# Altium project MCU.PrjPCB
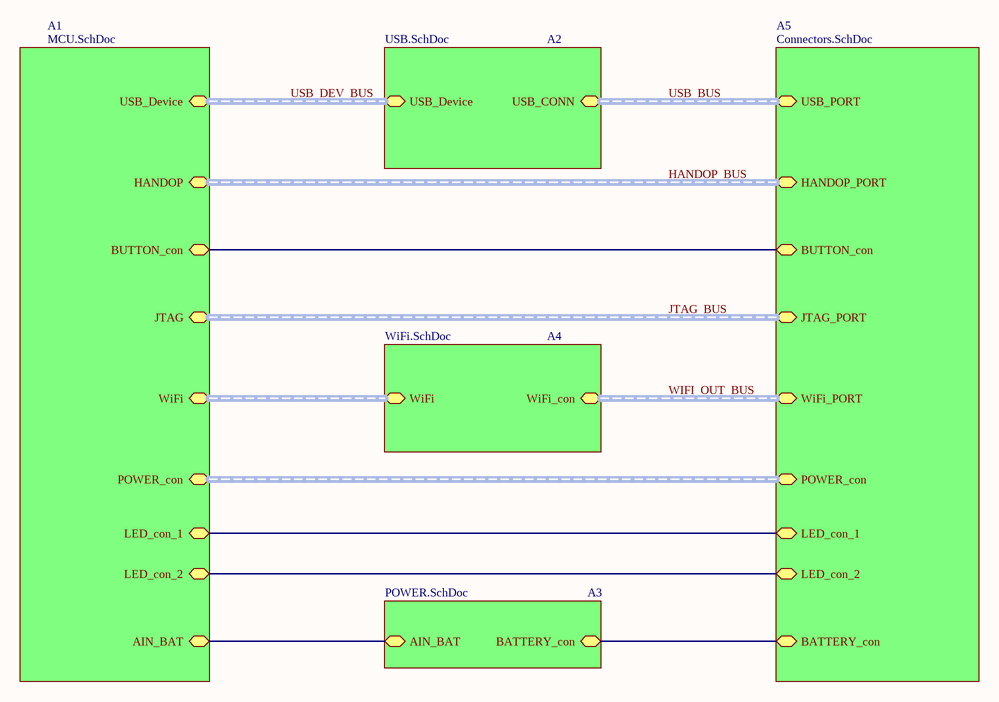
[diagram p0: main.SchDoc]
6 sheets, 81 parts. Net scope: hierarchical (ports join the sheet entries above them; power ports are global).
Board file: MCU.PcbDoc
Sheets:
  main.SchDoc
    A1 = MCU.SchDoc
    A2 = USB.SchDoc
    A3 = POWER.SchDoc
    A4 = WiFi.SchDoc
    A5 = Connectors.SchDoc

## Sheet main.SchDoc
size A4

### Sub-sheets
A1 = MCU.SchDoc: USB_Device (harness USB), WiFi (harness WiFi), AIN_BAT, HANDOP (harness HANDOP_connector), BUTTON_con, LED_con_1, POWER_con (harness POWER), JTAG (harness JTAG_connector), LED_con_2
A2 = USB.SchDoc: USB_Device (harness USB), USB_CONN (harness USB_connector)
A3 = POWER.SchDoc: AIN_BAT, BATTERY_con
A4 = WiFi.SchDoc: WiFi (harness WiFi), WiFi_con (harness WiFi_connector)
A5 = Connectors.SchDoc: WiFi_PORT (harness WiFi_connector), BATTERY_con, HANDOP_PORT (harness HANDOP_connector), BUTTON_con, LED_con_1, POWER_con (harness POWER), JTAG_PORT (harness JTAG_connector), USB_PORT (harness USB_connector), LED_con_2

### Nets
BUTTON_con: sheet A1/BUTTON_con, sheet A5/BUTTON_con
NetC24_1: sheet A1/AIN_BAT, sheet A3/AIN_BAT
NetR8_1: sheet A1/LED_con_1, sheet A5/LED_con_1
NetR15_2: sheet A3/BATTERY_con, sheet A5/BATTERY_con
NetR30_2: sheet A1/LED_con_2, sheet A5/LED_con_2

### Buses and harness runs
harness HANDOP_BUS = sheet A1/HANDOP = sheet A5/HANDOP_PORT
harness JTAG_BUS = sheet A1/JTAG = sheet A5/JTAG_PORT
harness sheet A1/POWER_con = sheet A5/POWER_con
harness sheet A1/WiFi = sheet A4/WiFi
harness USB_BUS = sheet A2/USB_CONN = sheet A5/USB_PORT
harness USB_DEV_BUS = sheet A1/USB_Device = sheet A2/USB_Device
harness WIFI_OUT_BUS = sheet A4/WiFi_con = sheet A5/WiFi_PORT

## Sheet MCU.SchDoc
size 420 x 297 mm; Scale: 1:1; DocumentType: Схема электрическая принципиальная; FirstReferrence: АБВГ.123456.001
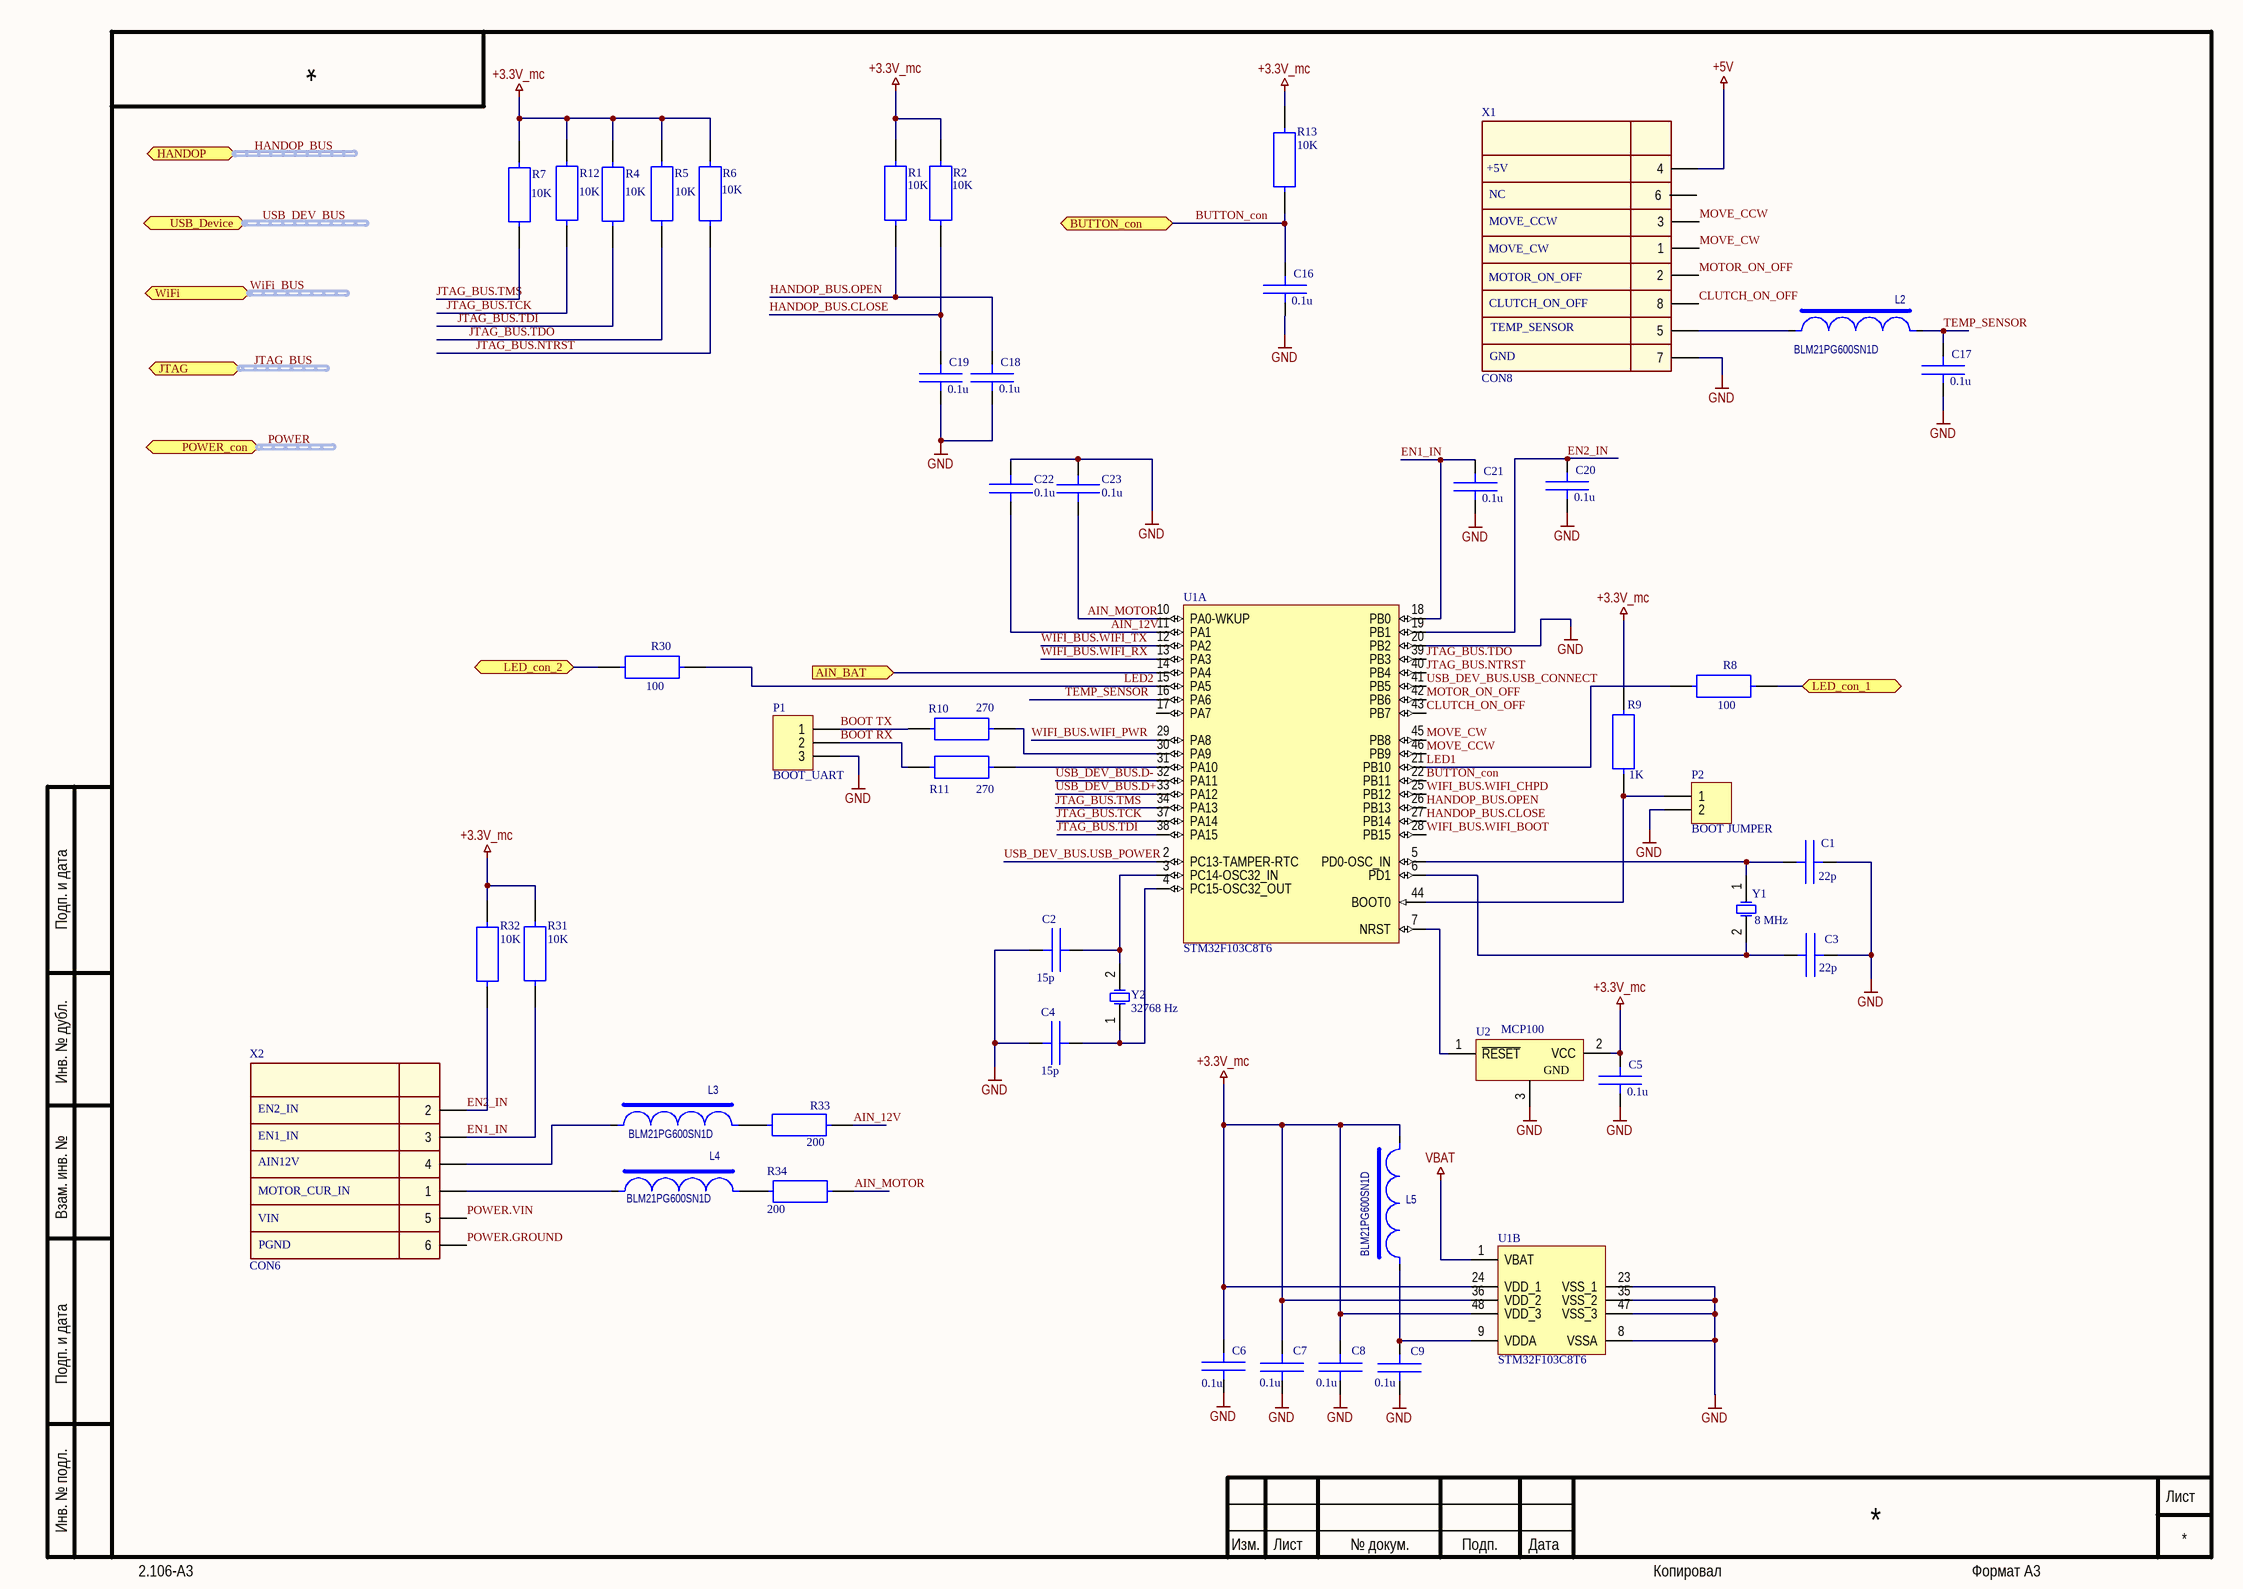
[diagram p1: MCU.SchDoc]

### Parts
C1  22p  [0603C]
C2  15p  [0603C]
C3  22p  [0603C]
C4  15p  [0603C]
C5  0.1u  [0603C]
C6  0.1u  [0603C]
C7  0.1u  [0603C]
C8  0.1u  [0603C]
C9  0.1u  [0603C]
C16  0.1u  [0603C]
C17  0.1u  [0603C]
C18  0.1u  [0603C]
C19  0.1u  [0603C]
C20  0.1u  [0603C]
C21  0.1u  [0603C]
C22  0.1u  [0603C]
C23  0.1u  [0603C]
L2  BLM21PG600SN1D  [0805]
L3  BLM21PG600SN1D  [0805]
L4  BLM21PG600SN1D  [0805]
L5  BLM21PG600SN1D  [0805]
P1  BOOT_UART  [HDR1X3]
P2  BOOT JUMPER  [HDR1X2]
R1  10K  [0603R]
R2  10K  [0603R]
R4  10K  [0603R]
R5  10K  [0603R]
R6  10K  [0603R]
R7  10K  [0603R]
R8  100  [0603R]
R9  1K  [0603R]
R10  270  [0603R]
R11  270  [0603R]
R12  10K  [0603R]
R13  10K  [0603R]
R30  100  [0603R]
R31  10K  [0603R]
R32  10K  [0603R]
R33  200  [0603R]
R34  200  [0603R]
U1  STM32F103C8T6  [LQFP48_L]  (parts A,B of 2)
U2  MCP100  [SOT95P230X110-3L]
X1  CON8  [HDR2X4_CEN]
X2  CON6  [HDR2X3_CEN]
Y1  8 MHz  [HC49(CRYSTAL)]
Y2  32768 Hz  [XTAL 32kHz -1]

### Ports
AIN_BAT (in), BUTTON_con, HANDOP (harness HANDOP_connector), JTAG (harness JTAG_connector), LED_con_1, LED_con_2, POWER_con (harness POWER), USB_Device (harness USB), WiFi (harness WiFi)

### Nets
+3.3V_mc: C5.2 C6.2 C7.2 C8.2 L5.2 R1.2 R2.2 R4.2 R5.2 R6.2 R7.2 R9.2 R12.2 R13.2 R31.1 R32.1 U1.24(VDD_1) U1.36(VDD_2) U1.48(VDD_3) U2.2(VСС)
+5V: X1.4
GND: C1.1 C2.1 C3.1 C4.1 C5.1 C6.1 C7.1 C8.1 C9.1 C16.1 C17.1 C18.1 C19.1 C20.1 C21.1 C22.1 C23.1 P1.3 P2.2 U1.8(VSSA) U1.20(PB2) U1.23(VSS_1) U1.35(VSS_2) U1.47(VSS_3) U2.3(GND) X1.7
VBAT: U1.1(VBAT)
AIN_12V: C22.2 R33.2 U1.11(PA1)
AIN_MOTOR: C23.2 R34.2 U1.10(PA0-WKUP)
BOOT RX: P1.2 R11.1
BOOT TX: P1.1 R10.1
BUTTON_con: C16.2 R13.1 U1.22(PB11) ; port BUTTON_con
CLUTCH_ON_OFF: U1.43(PB7) X1.8
EN1_IN: C21.2 R31.2 U1.18(PB0) X2.3
EN2_IN: C20.2 R32.2 U1.19(PB1) X2.2
HANDOP_BUS.CLOSE: C19.2 R2.1 U1.27(PB14)
HANDOP_BUS.OPEN: C18.2 R1.1 U1.26(PB13)
JTAG_BUS.NTRST: R6.1 U1.40(PB4)
JTAG_BUS.TCK: R12.1 U1.37(PA14)
JTAG_BUS.TDI: R4.1 U1.38(PA15)
JTAG_BUS.TDO: R5.1 U1.39(PB3)
JTAG_BUS.TMS: R7.1 U1.34(PA13)
LED1: R8.2 U1.21(PB10)
LED2: R30.1 U1.15(PA5)
MOTOR_ON_OFF: U1.42(PB6) X1.2
MOVE_CCW: U1.46(PB9) X1.3
MOVE_CW: U1.45(PB8) X1.1
POWER.GROUND: X2.6
POWER.VIN: X2.5
TEMP_SENSOR: C17.2 L2.2 U1.16(PA6)
USB_DEV_BUS.D+: U1.33(PA12)
USB_DEV_BUS.D-: U1.32(PA11)
USB_DEV_BUS.USB_CONNECT: U1.41(PB5)
USB_DEV_BUS.USB_POWER: U1.2(PC13-TAMPER-RTC)
WIFI_BUS.WIFI_BOOT: U1.28(PB15)
WIFI_BUS.WIFI_CHPD: U1.25(PB12)
WIFI_BUS.WIFI_PWR: U1.29(PA8)
WIFI_BUS.WIFI_RX: U1.13(PA3)
WIFI_BUS.WIFI_TX: U1.12(PA2)
NetC1_2: C1.2 U1.5(PD0-OSC_IN) Y1.1(OSC1)
NetC2_2: C2.2 U1.3(PC14-OSC32_IN) Y2.2(OSC2)
NetC3_2: C3.2 U1.6(PD1) Y1.2(OSC2)
NetC4_2: C4.2 U1.4(PC15-OSC32_OUT) Y2.1(OSC1)
NetC9_2: C9.2 L5.1 U1.9(VDDA)
NetC24_1: U1.14(PA4) ; port AIN_BAT
NetL2_1: L2.1 X1.5
NetL3_1: L3.1 X2.4
NetL3_2: L3.2 R33.1
NetL4_1: L4.1 X2.1
NetL4_2: L4.2 R34.1
NetP2_1: P2.1 R9.1 U1.44(BOOT0)
NetR8_1: R8.1 ; port LED_con_1
NetR10_2: R10.2 U1.30(PA9)
NetR11_2: R11.2 U1.31(PA10)
NetR30_2: R30.2 ; port LED_con_2
NetU1_7: U1.7(NRST) U2.1(~{RESET})

Not connected (* = marked no-connect by the designer): U1 17(PA7); X1 6

### Buses and harness runs
harness HANDOP_BUS = port HANDOP
harness JTAG_BUS = port JTAG
harness POWER = port POWER_con
harness USB_DEV_BUS = port USB_Device
harness WiFi_BUS = port WiFi

### Notes on the sheet
- +5V
- MOVE_CW
- MOVE_CCW
- NC
- MOTOR_ON_OFF
- CLUTCH_ON_OFF
- GND
- TEMP_SENSOR
- EN1_IN
- EN2_IN
- MOTOR_CUR_IN
- AIN12V
- VIN
- PGND
- Подп. и дата
- Инв. № дубл.
- Взам. инв. №
- Инв. № подл.
- Изм.
- Лист
- № докум.
- Подп.
- Дата
- 2.106-A3
- Копировал
- Формат А3

### Library data of the parts
C1-C9 C16-C23 = CAP: Конденсатор обыкновенный
  C1 C3: Value: 22p
  C2 C4: Value: 15p
  C5-C9 C16-C23: Value: 0.1u
L2-L5 = INDUCTOR_: Индуктивность
P1 = Header 3: Header, 3-Pin; LatestRevisionDate: 17-Jul-2002; LatestRevisionNote: Re-released for DXP Platform.; Publisher: Altium Limited
P2 = Header 2: Header, 2-Pin; LatestRevisionDate: 17-Jul-2002; LatestRevisionNote: Re-released for DXP Platform.; Publisher: Altium Limited
R1 R2 R4-R13 R30-R34 = RES: Резистор обыкновенный
  R1 R2 R4-R7 R12 R13 R31 R32: Value: 10K
  R8 R30: Value: 100
  R9: Value: 1K
  R10 R11: Value: 270
  R33 R34: Value: 200
U1 = STM32F103C8T6: STM32 ARM-based 32-bit MCU Performance Line with 64 kB Flash, 20 kB Internal RAM, -40 to +85°C Temperature, 48-Pin LQFP, Tray; DatasheetVersion: rev13.0, Apr-2011; PackageVersion: rev13, Apr-2011; PackageReference: LQFP48; PackageDescription: 48-Pin Low-Profile Quad Flat Pack, 7 x 7 mm Body, 0.5 mm Pitch (LQFP48); ComponentLink1Description: Manufacturer URL; ComponentLink1URL: http://www.st.com/; ComponentLink2Description: STM32F103 Datasheet; ComponentLink2URL: http://www.st.com/internet/com/TECHNICAL_RESOURCES/TECHNICAL_LITERATURE/DATASHEET/CD00161566.pdf; ComponentLink3Description: STM32 Family Web Page; ComponentLink3URL: www.st.com/stm32
U2 = RESET_CIRCUIT: RESET CIRCUIT
X1 = CON8: штыри(папа)
X2 = CON6: штыри(папа)
Y1 Y2 = XTAL: Crystal Oscillator; Published: 8-Jun-2000; LatestRevisionDate: 17-Jul-2002; LatestRevisionNote: Re-released for DXP Platform.; PackageReference: R38; Publisher: Altium Limited; PackageDescription: Crystal, Thru-Hole; 2 Leads; Body 3.1 x 8.2 mm (Dia.xH)

## Sheet USB.SchDoc
size 420 x 297 mm; Scale: 1:1; DocumentType: Схема электрическая принципиальная; FirstReferrence: АБВГ.123456.001
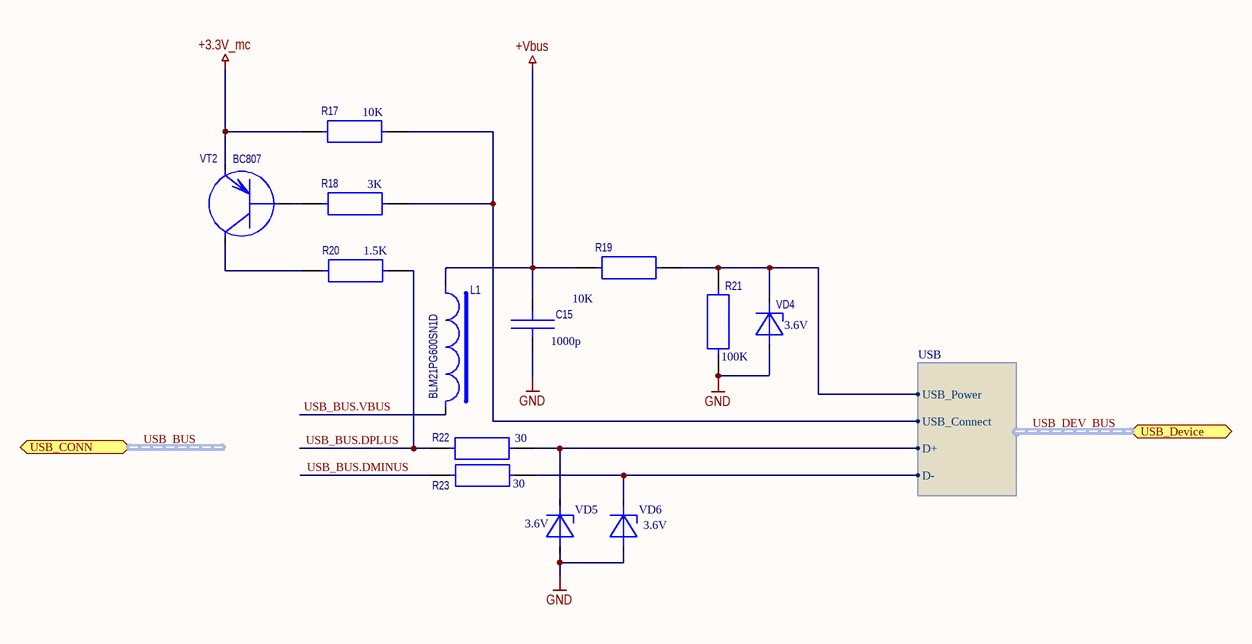
[diagram p2: USB.SchDoc]

### Parts
C15  1000p  [0603C]
L1  BLM21PG600SN1D  [0805]
R17  10K  [0603R]
R18  3K  [0603R]
R19  10K  [0603R]
R20  1.5K  [0603R]
R21  100K  [0603R]
R22  30  [0603R]
R23  30  [0603R]
VD4  value 3.6V  [SOT23_1DIODE]  (hidden comment: BZX84C3V6)
VD5  value 3.6V  [SOT23_1DIODE]  (hidden comment: BZX84C3V6)
VD6  value 3.6V  [SOT23_1DIODE]  (hidden comment: BZX84C3V6)
VT2  BC807  [SOT95P230X110-3L]

### Ports
USB_CONN (harness USB_connector), USB_Device (harness USB)

### Harnesses
USB: USB_Connect, USB_Power, D+, D-

### Nets
+3.3V_mc: R17.2 VT2.2(E)
+Vbus: C15.2 L1.1 R19.2
GND: C15.1 R21.1 VD4.A VD5.A VD6.A
USB_BUS.DMINUS: R23.1
USB_BUS.DPLUS: R20.1 R22.1
USB_BUS.VBUS: L1.2
USB_DEV_BUS.D+: R22.2 VD5.K ; port USB_Device.D+
USB_DEV_BUS.D-: R23.2 VD6.K ; port USB_Device.D-
USB_DEV_BUS.USB_Connect: R17.1 R18.1 ; port USB_Device.USB_Connect
USB_DEV_BUS.USB_Power: R19.1 R21.2 VD4.K ; port USB_Device.USB_Power
NetR18_2: R18.2 VT2.1(B)
NetR20_2: R20.2 VT2.3(C)

### Buses and harness runs
harness USB_BUS = port USB_CONN
harness USB_DEV_BUS = port USB_Device

### Notes on the sheet
- Подп. и дата
- Инв. № дубл.
- Взам. инв. №
- Инв. № подл.
- Изм.
- Лист
- № докум.
- Подп.
- Дата
- 2.106-A3
- Копировал
- Формат А3

### Library data of the parts
C15 = CAP: Конденсатор обыкновенный; Value: 1000p
L1 = INDUCTOR_: Индуктивность
R17-R23 = RES: Резистор обыкновенный
  R17 R19: Value: 10K
  R18: Value: 3K
  R20: Value: 1.5K
  R21: Value: 100K
  R22 R23: Value: 30
VD4-VD6 = ZENNER: Стабилитрон
VT2 = SOT32_PNP: Биполярный PNP транзистор

## Sheet POWER.SchDoc
size A4
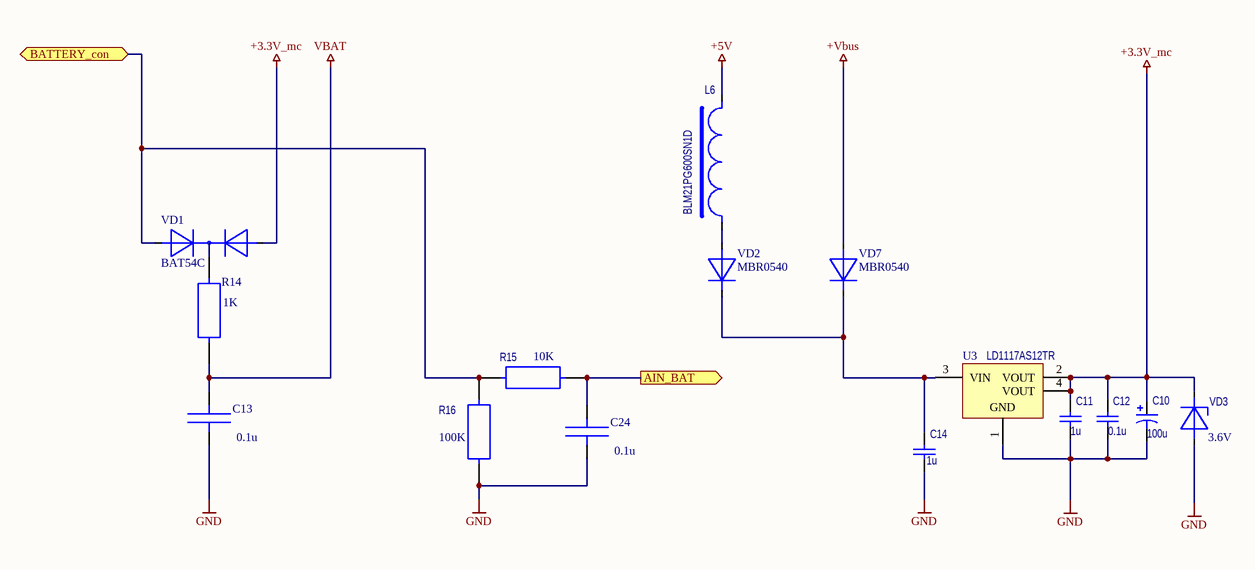
[diagram p3: POWER.SchDoc]

### Parts
C10  value 100u  [CAP 5X...Х2]  (hidden comment: 100u 6.3V)
C11  1u  [1206C]
C12  0.1u  [0603C]
C13  0.1u  [0603C]
C14  1u  [0603C]
C24  0.1u  [0603C]
L6  BLM21PG600SN1D  [0805]
R14  1K  [0603R]
R15  10K  [0603R]
R16  100K  [0603R]
U3  LD1117AS12TR  [SOT223]
VD1  BAT54C  [SOT95P230X110-3L]
VD2  MBR0540  [SOD123]
VD3  value 3.6V  [SOT23_1DIODE]  (hidden comment: BZX84C3V6)
VD7  MBR0540  [SOD123]

### Ports
AIN_BAT (out), BATTERY_con

### Nets
+3.3V_mc: C10.1 C11.2 C12.2 U3.2(VOUT) U3.4(VOUT) VD1.1(A1) VD3.K
+5V: L6.2
+Vbus: VD7.A
GND: C10.2 C11.1 C12.1 C13.2 C14.1 C24.2 R16.1 U3.1(GND) VD3.A
VBAT: C13.1 R14.2
NetC14_2: C14.2 U3.3(VIN) VD2.K VD7.K
NetC24_1: C24.1 R15.1 ; port AIN_BAT
NetL6_1: L6.1 VD2.A
NetR14_1: R14.1 VD1.3(K)
NetR15_2: R15.2 R16.2 VD1.2(A2) ; port BATTERY_con

### Library data of the parts
C10 = Cap Pol1: Polarized Capacitor (Radial); Published: 8-Jun-2000; LatestRevisionDate: 17-Jul-2002; LatestRevisionNote: Re-released for DXP Platform.; PackageReference: RB7.6-15; Publisher: Altium Limited
C11 C12 C14 = Cap: Capacitor; Published: 8-Jun-2000; LatestRevisionDate: 17-Jul-2002; LatestRevisionNote: Re-released for DXP Platform.; PackageReference: RAD-0.3; Publisher: Altium Limited
  C11 C14: Value: 1u
  C12: Value: 0.1u
C13 C24 = CAP: Конденсатор обыкновенный; Part Name: C-0603Y5V-104-20% (50v); Value: 0.1u
L6 = INDUCTOR_: Индуктивность
R14 = RES: Резистор обыкновенный; Part Name: R-0603-270R-5; Value: 1K
R15 R16 = RES: Резистор обыкновенный
  R15: Value: 10K
  R16: Value: 100K
U3 = LD1117AS12TR: 1A, Low Drop Positive Voltage Regulator, 1.2V, 4-Pin SOT-223, Tape and Reel; DatasheetVersion: Dec-2011; PackageVersion: 2010; PackageReference: SOT-223; PackageDescription: 4-Pin SOT-223 Package, 6.5 x 3.5 mm Body, 2.3 mm Pitch, 7 mm Lead Span; PartNumber: LD1117AS12TR; ComponentLink1Description: Manufacturer URL; ComponentLink1URL: http://www.st.com; ComponentLink2Description: Datasheet; ComponentLink2URL: http://www.st.com/internet/com/TECHNICAL_RESOURCES/TECHNICAL_LITERATURE/DATASHEET/CD00002116.pdf
VD1 = DIODE_PAIR_C: диодная сборка(общий катод); Part Name: BAT54C
VD2 VD7 = DIODE: Диод
VD3 = ZENNER: Стабилитрон

## Sheet WiFi.SchDoc
size A4
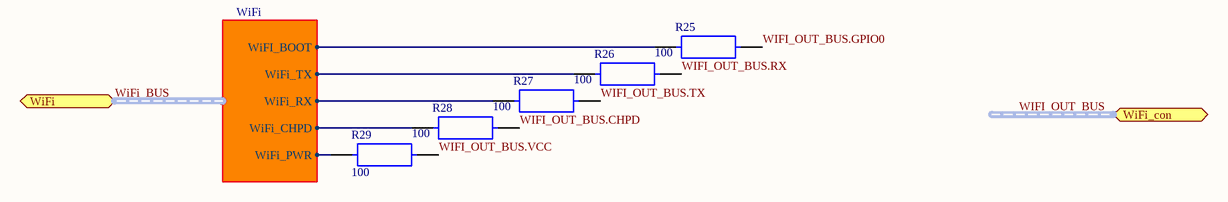
[diagram p4: WiFi.SchDoc]

### Parts
R25  100  [0603R]
R26  100  [0603R]
R27  100  [0603R]
R28  100  [0603R]
R29  100  [0603R]

### Ports
WiFi (harness WiFi), WiFi_con (harness WiFi_connector)

### Harnesses
WiFi: WiFi_PWR, WiFi_CHPD, WiFi_RX, WiFi_TX, WiFI_BOOT

### Nets
WiFi_BUS.WiFI_BOOT: R25.2 ; port WiFi.WiFI_BOOT
WiFi_BUS.WiFi_CHPD: R28.2 ; port WiFi.WiFi_CHPD
WiFi_BUS.WiFi_PWR: R29.2 ; port WiFi.WiFi_PWR
WiFi_BUS.WiFi_RX: R27.2 ; port WiFi.WiFi_RX
WiFi_BUS.WiFi_TX: R26.2 ; port WiFi.WiFi_TX
WIFI_OUT_BUS.CHPD: R28.1
WIFI_OUT_BUS.GPIO0: R25.1
WIFI_OUT_BUS.RX: R26.1
WIFI_OUT_BUS.TX: R27.1
WIFI_OUT_BUS.VCC: R29.1

### Buses and harness runs
harness WiFi_BUS = port WiFi
harness WIFI_OUT_BUS = port WiFi_con

### Library data of the parts
R25-R29 = RES: Резистор обыкновенный; Value: 100

## Sheet Connectors.SchDoc
size A4
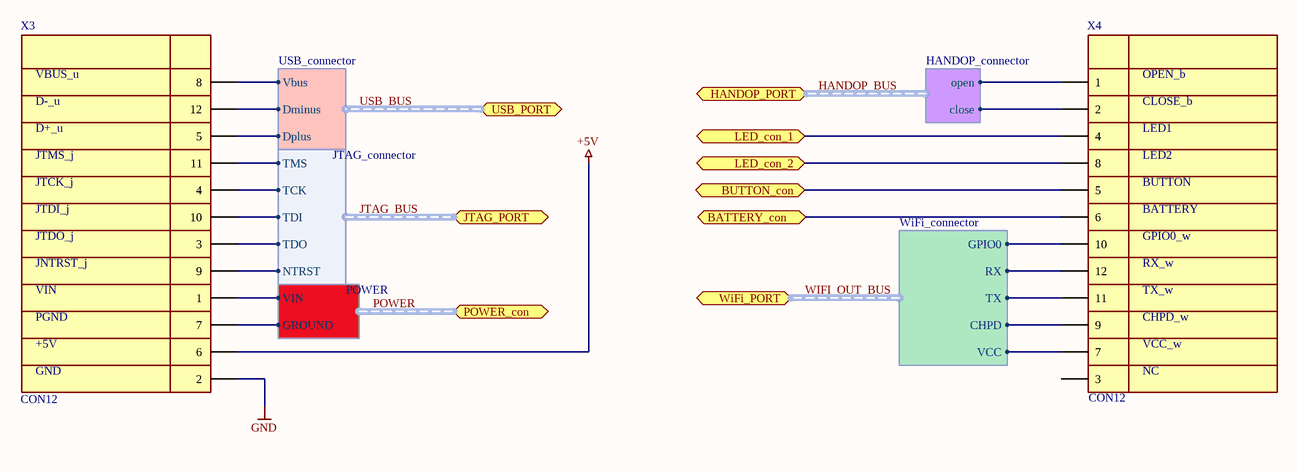
[diagram p5: Connectors.SchDoc]

### Parts
X3  CON12  [HDR2X6_CEN]
X4  CON12  [HDR2X6_CEN]

### Ports
BATTERY_con, BUTTON_con, HANDOP_PORT (harness HANDOP_connector), JTAG_PORT (harness JTAG_connector), LED_con_1, LED_con_2, POWER_con (harness POWER), USB_PORT (harness USB_connector), WiFi_PORT (harness WiFi_connector)

### Harnesses
HANDOP_connector: open, close
WiFi_connector: GPIO0, RX, TX, CHPD, VCC
POWER: VIN, GROUND
JTAG_connector: TMS, TCK, TDI, TDO, NTRST
USB_connector: Vbus, Dminus, Dplus

### Nets
+5V: X3.6
GND: X3.2
BUTTON_con: X4.5 ; port BUTTON_con
HANDOP_BUS.close: X4.2 ; port HANDOP_PORT.close
HANDOP_BUS.open: X4.1 ; port HANDOP_PORT.open
JTAG_BUS.NTRST: X3.9 ; port JTAG_PORT.NTRST
JTAG_BUS.TCK: X3.4 ; port JTAG_PORT.TCK
JTAG_BUS.TDI: X3.10 ; port JTAG_PORT.TDI
JTAG_BUS.TDO: X3.3 ; port JTAG_PORT.TDO
JTAG_BUS.TMS: X3.11 ; port JTAG_PORT.TMS
POWER.GROUND: X3.7 ; port POWER_con.GROUND
POWER.VIN: X3.1 ; port POWER_con.VIN
USB_BUS.Dminus: X3.12 ; port USB_PORT.Dminus
USB_BUS.Dplus: X3.5 ; port USB_PORT.Dplus
USB_BUS.Vbus: X3.8 ; port USB_PORT.Vbus
WIFI_OUT_BUS.CHPD: X4.9 ; port WiFi_PORT.CHPD
WIFI_OUT_BUS.GPIO0: X4.10 ; port WiFi_PORT.GPIO0
WIFI_OUT_BUS.RX: X4.12 ; port WiFi_PORT.RX
WIFI_OUT_BUS.TX: X4.11 ; port WiFi_PORT.TX
WIFI_OUT_BUS.VCC: X4.7 ; port WiFi_PORT.VCC
NetR8_1: X4.4 ; port LED_con_1
NetR15_2: X4.6 ; port BATTERY_con
NetR30_2: X4.8 ; port LED_con_2

Not connected (* = marked no-connect by the designer): X4 3

### Buses and harness runs
harness HANDOP_BUS = port HANDOP_PORT
harness JTAG_BUS = port JTAG_PORT
harness POWER = port POWER_con
harness USB_BUS = port USB_PORT
harness WIFI_OUT_BUS = port WiFi_PORT

### Notes on the sheet
- VBUS_u
- D-_u
- D+_u
- OPEN_b
- CLOSE_b
- LED1
- JTMS_j
- JTCK_j
- BUTTON
- LED2
- JTDI_j
- JTDO_j
- JNTRST_j
- BATTERY
- GPIO0_w
- RX_w
- VIN
- PGND
- TX_w
- CHPD_w
- +5V
- GND
- NC
- VCC_w

### Library data of the parts
X3 X4 = CON12: штыри(мама)

## Nets that join several sheets
+3.3V_mc: MCU (20 pins), USB (R17.2 VT2.2), POWER (7 pins)
+5V: MCU (X1.4), POWER (L6.2), Connectors (X3.6)
+Vbus: USB (C15.2 L1.1 R19.2), POWER (VD7.A)
GND: MCU (26 pins), USB (5 pins), POWER (9 pins), Connectors (X3.2)
VBAT: MCU (U1.1), POWER (C13.1 R14.2)
BUTTON_con: MCU (C16.2 R13.1 U1.22), Connectors (X4.5)
NetC24_1: MCU (U1.14), POWER (C24.1 R15.1)
NetR8_1: MCU (R8.1), Connectors (X4.4)
NetR15_2: POWER (R15.2 R16.2 VD1.2), Connectors (X4.6)
NetR30_2: MCU (R30.2), Connectors (X4.8)